# Altium schematic sheet Audio.SchDoc
size A4
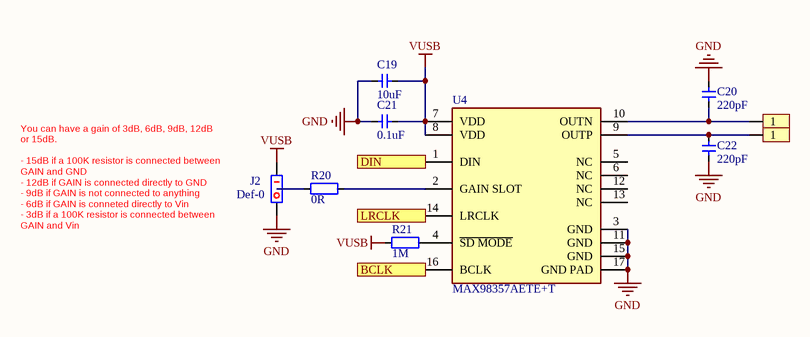
[diagram p0: Audio.SchDoc]

## Parts
*1  SPEAKER  [SPEAKER]  (value not drawn)
*2  SPEAKER  [SPEAKER]  (value not drawn)
C19  10uF  [CAP_0402]
C20  220pF  [CAP_0402]
C21  0.1uF  [CAP_0402]
C22  220pF  [CAP_0402]
J2  Def-0  [jumper-3]
R20  0R  [RES_0402]
R21  1M  [RES_0402]
U4  Part Number: MAX98357AETE+T  [TQFN-16]  (hidden comment: MAX98357AETE)

## Ports
BCLK (in), DIN (in), LRCLK (in)

## Nets
GND: C19.1 C20.2 C21.1 C22.2 J2.1 U4.3(GND) U4.11(GND) U4.15(GND) U4.17(GND_PAD)
VUSB: C19.2 C21.2 J2.3 R21.1 U4.7(VDD) U4.8(VDD)
BCLK: U4.16(BCLK) ; port BCLK
DIN: U4.1(DIN) ; port DIN
LRCLK: U4.14(LRCLK) ; port LRCLK
Net*1_1: *1.1 C20.1 U4.10(OUTN)
Net*2_1: *2.1 C22.1 U4.9(OUTP)
NetJ2_2: J2.2 R20.1
NetR20_2: R20.2 U4.2(GAIN_SLOT)
NetR21_2: R21.2 U4.4(~{SD_MODE})

Not connected (* = marked no-connect by the designer): U4 5(NC) 6(NC) 12(NC) 13(NC)

## Notes on the sheet
- You can have a gain of 3dB, 6dB, 9dB, 12dB or 15dB.
  - 15dB if a 100K resistor is connected between GAIN and GND
  - 12dB if GAIN is connected directly to GND
  - 9dB if GAIN is not connected to anything
  - 6dB if GAIN is conneted directly to Vin
  - 3dB if a 100K resistor is connected between GAIN and Vin

## Library data of the parts
C19-C22 = 电容-0402: Capacitor; Value: 0.1u
J2 = 选择跳线: Resistor; Published: 8-Jun-2000; LatestRevisionDate: 17-Jul-2002; LatestRevisionNote: Re-released for DXP Platform.; PackageReference: AXIAL-0.4; Publisher: Altium Limited; PackageDescription: Axial Device, Thru-Hole; 2 Leads; 0.4 in Pin Spacing
R20 R21 = 电阻-0402: Resistor; Value: 22R
U4 = MAX98357AETE: IC Amplifier IC 2-Channel (Stereo) Class D 16-TQFN (3x3); Manufacturer: Maxim Electronics; Mfg Package Ident: 21-0896; helpURL: https://upverter.com/upn/revision/0f54a4b5bdb80fd2/; ComponentLink2Description: Datasheet; Temperature: +40°C to +85°C; Package: 21-0896; Supplier 2: Mouser; Price: 1.00367999051; Supplier 1: Digi-Key; ComponentLink1URL: https://upverter.com/upn/revision/0f54a4b5bdb80fd2/; Supplier Part Number 2: 700-MAX98357AETE+T; Supplier Part Number 1: MAX98357AETE+T-ND; ComponentLink1Description: Upverter; ComponentLink2URL: http://datasheets.maximintegrated.com/en/ds/MAX98357A-MAX98357B.pdf; RoHS: TRUE; Mouser Part Number: 700-MAX98357AETE+T; Temperature Range High: +85°C; Digikey Description: IC Amplifier IC 2-Channel (Stereo) Class D 16-TQFN (3x3); Digikey Part Number: MAX98357AETE+T-ND; Lead Free: yes; Temperature Range Low: +40°C